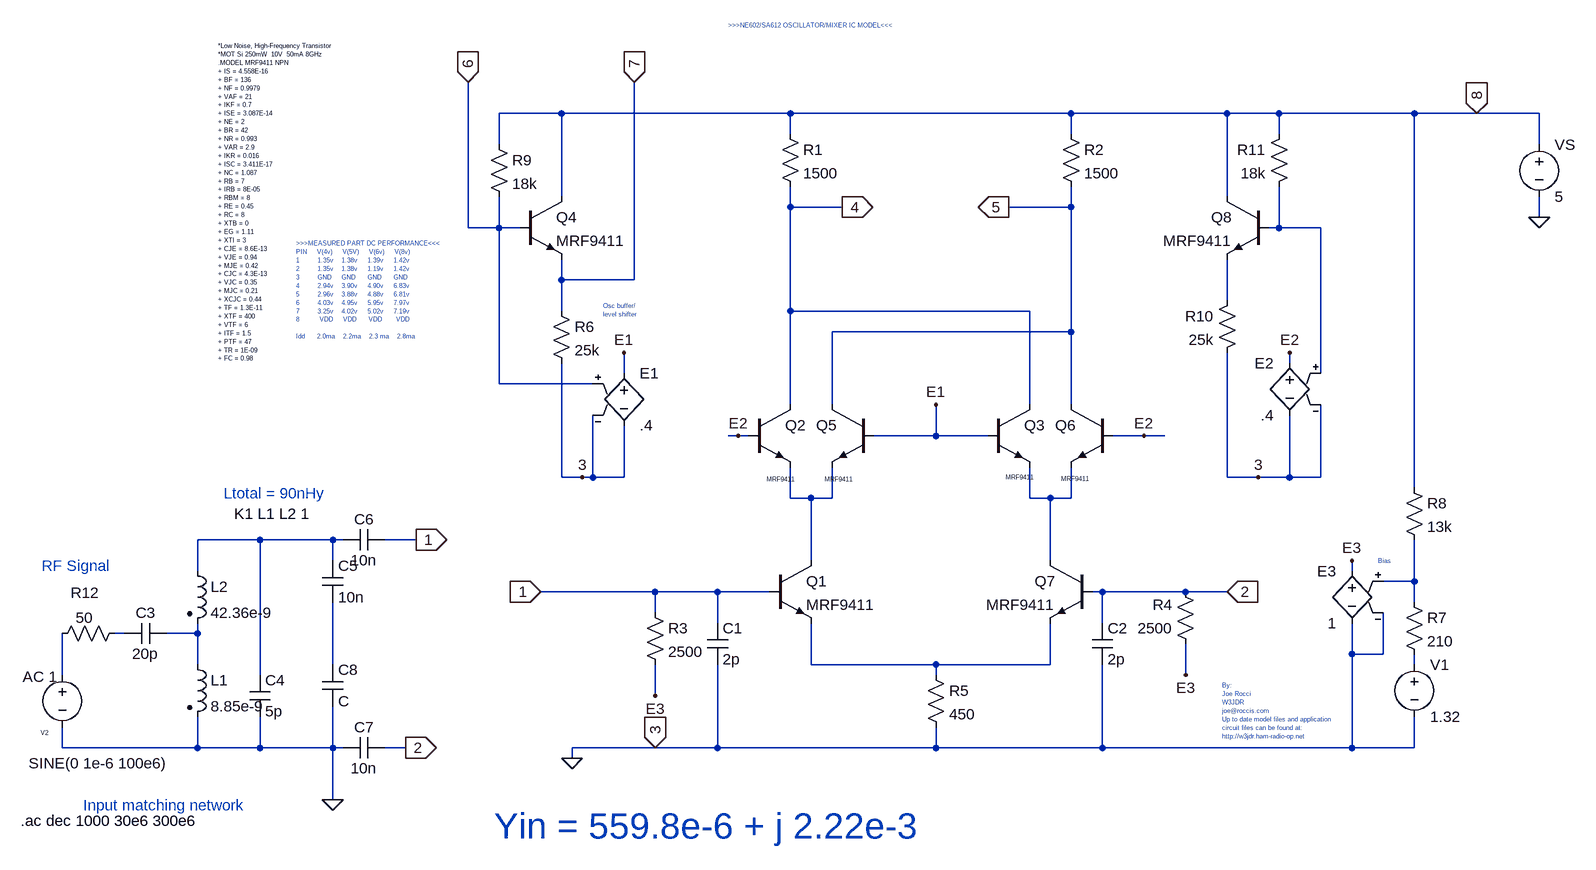
[diagram p0: schematic Mezclador_entrada.asc]
Mezclador_entrada.asc, the LTspice schematic file:
Version 4
SHEET 1 1112 816
WIRE -448 -384 -544 -384
WIRE -96 -384 -448 -384
WIRE 336 -384 -96 -384
WIRE 576 -384 336 -384
WIRE 656 -384 576 -384
WIRE 864 -384 656 -384
WIRE 960 -384 864 -384
WIRE 1056 -384 960 -384
WIRE -96 -352 -96 -384
WIRE 336 -352 336 -384
WIRE 656 -352 656 -384
WIRE -544 -336 -544 -384
WIRE 1056 -336 1056 -384
WIRE -448 -256 -448 -384
WIRE 576 -256 576 -384
WIRE -96 -240 -96 -272
WIRE -16 -240 -96 -240
WIRE 336 -240 336 -272
WIRE 336 -240 240 -240
WIRE 1056 -224 1056 -256
WIRE -592 -208 -592 -432
WIRE -544 -208 -544 -256
WIRE -544 -208 -592 -208
WIRE -512 -208 -544 -208
WIRE 656 -208 656 -272
WIRE 656 -208 640 -208
WIRE 720 -208 656 -208
WIRE -448 -128 -448 -160
WIRE -336 -128 -336 -432
WIRE -336 -128 -448 -128
WIRE 576 -96 576 -160
WIRE -448 -80 -448 -128
WIRE -96 -80 -96 -240
WIRE 272 -80 -96 -80
WIRE 336 -48 336 -240
WIRE 336 -48 -32 -48
WIRE 672 0 672 -16
WIRE -352 16 -352 -16
WIRE 720 16 720 -208
WIRE -544 32 -544 -208
WIRE -400 32 -544 32
WIRE -96 64 -96 -80
WIRE -32 64 -32 -48
WIRE 272 64 272 -80
WIRE 336 64 336 -48
WIRE -176 112 -192 112
WIRE -160 112 -176 112
WIRE 128 112 128 64
WIRE 128 112 32 112
WIRE 208 112 128 112
WIRE 448 112 400 112
WIRE 480 112 448 112
WIRE -448 176 -448 0
WIRE -416 176 -448 176
WIRE -400 176 -400 80
WIRE -400 176 -416 176
WIRE -352 176 -352 96
WIRE -352 176 -400 176
WIRE 576 176 576 -16
WIRE 624 176 576 176
WIRE 672 176 672 80
WIRE 672 176 624 176
WIRE 720 176 720 64
WIRE 720 176 672 176
WIRE 864 192 864 -384
WIRE -96 208 -96 160
WIRE -64 208 -96 208
WIRE -32 208 -32 160
WIRE -32 208 -64 208
WIRE 272 208 272 160
WIRE 304 208 272 208
WIRE 336 208 336 160
WIRE 336 208 304 208
WIRE -912 272 -1008 272
WIRE -800 272 -912 272
WIRE -784 272 -800 272
WIRE -672 272 -720 272
WIRE -800 304 -800 272
WIRE -64 304 -64 208
WIRE 304 304 304 208
WIRE -1008 320 -1008 272
WIRE 768 320 768 304
WIRE 864 336 864 272
WIRE 864 336 816 336
WIRE -304 352 -480 352
WIRE -208 352 -304 352
WIRE -128 352 -208 352
WIRE 384 352 368 352
WIRE 512 352 384 352
WIRE 576 352 512 352
WIRE 864 368 864 336
WIRE -304 384 -304 352
WIRE -208 400 -208 352
WIRE 384 400 384 352
WIRE -1120 416 -1136 416
WIRE -1008 416 -1008 400
WIRE -1008 416 -1056 416
WIRE 768 448 768 400
WIRE 816 448 816 384
WIRE 816 448 768 448
WIRE -1008 464 -1008 416
WIRE -800 464 -800 368
WIRE -64 464 -64 400
WIRE 128 464 -64 464
WIRE 304 464 304 400
WIRE 304 464 128 464
WIRE 864 464 864 448
WIRE -1216 480 -1216 416
WIRE -912 480 -912 272
WIRE 128 480 128 464
WIRE 512 480 512 432
WIRE -304 512 -304 464
WIRE -1216 592 -1216 560
WIRE -1008 592 -1008 544
WIRE -1008 592 -1216 592
WIRE -912 592 -912 544
WIRE -912 592 -1008 592
WIRE -800 592 -800 528
WIRE -800 592 -912 592
WIRE -784 592 -800 592
WIRE -688 592 -720 592
WIRE -304 592 -432 592
WIRE -208 592 -208 464
WIRE -208 592 -304 592
WIRE 128 592 128 560
WIRE 128 592 -208 592
WIRE 384 592 384 464
WIRE 384 592 128 592
WIRE 768 592 768 448
WIRE 768 592 384 592
WIRE 864 592 864 544
WIRE 864 592 768 592
WIRE -432 608 -432 592
WIRE -800 672 -800 592
FLAG 240 -240 5
IOPIN 240 -240 Out
FLAG -16 -240 4
IOPIN -16 -240 Out
FLAG 960 -384 8
IOPIN 960 -384 In
FLAG -592 -432 6
IOPIN -592 -432 In
FLAG -336 -432 7
IOPIN -336 -432 In
FLAG 576 352 2
IOPIN 576 352 In
FLAG -480 352 1
IOPIN -480 352 In
FLAG -304 592 3
IOPIN -304 592 In
FLAG -352 -16 E1
FLAG 128 64 E1
FLAG -176 112 E2
FLAG 448 112 E2
FLAG 672 -16 E2
FLAG -416 176 3
FLAG 624 176 3
FLAG -304 512 E3
FLAG 512 480 E3
FLAG 768 304 E3
FLAG -432 608 0
FLAG 1056 -224 0
FLAG -672 272 1
IOPIN -672 272 Out
FLAG -688 592 2
IOPIN -688 592 Out
FLAG -800 672 0
SYMBOL npn -128 304 R0
SYMATTR InstName Q1
SYMATTR Value MRF9411
SYMBOL res -112 -368 R0
SYMATTR InstName R1
SYMATTR Value 1500
SYMBOL res 320 -368 R0
SYMATTR InstName R2
SYMATTR Value 1500
SYMBOL res -320 368 R0
SYMATTR InstName R3
SYMATTR Value 2500
SYMBOL res 528 448 R180
WINDOW 0 36 76 Left 2
WINDOW 3 36 40 Left 2
SYMATTR InstName R4
SYMATTR Value 2500
SYMBOL res 112 464 R0
SYMATTR InstName R5
SYMATTR Value 450
SYMBOL res -464 -96 R0
SYMATTR InstName R6
SYMATTR Value 25k
SYMBOL res 848 352 R0
SYMATTR InstName R7
SYMATTR Value 210
SYMBOL voltage 864 448 R0
WINDOW 123 0 0 Left 0
WINDOW 39 0 0 Left 0
SYMATTR InstName V1
SYMATTR Value 1.32
SYMBOL res 848 176 R0
SYMATTR InstName R8
SYMATTR Value 13k
SYMBOL res -560 -352 R0
SYMATTR InstName R9
SYMATTR Value 18k
SYMBOL res 592 -112 M0
SYMATTR InstName R10
SYMATTR Value 25k
SYMBOL res 672 -368 M0
SYMATTR InstName R11
SYMATTR Value 18k
SYMBOL e -352 0 R0
SYMATTR InstName E1
SYMATTR Value .4
SYMBOL e 672 -16 M0
SYMATTR InstName E2
SYMATTR Value .4
SYMBOL npn -160 64 R0
WINDOW 3 117 115 Left 0
SYMATTR Value MRF9411
SYMATTR InstName Q2
SYMBOL npn 208 64 R0
WINDOW 3 113 114 Left 0
SYMATTR Value MRF9411
SYMATTR InstName Q3
SYMBOL npn -512 -256 R0
SYMATTR InstName Q4
SYMATTR Value MRF9411
SYMBOL npn 32 64 M0
WINDOW 3 120 115 Left 0
SYMATTR Value MRF9411
SYMATTR InstName Q5
SYMBOL npn 400 64 M0
WINDOW 3 120 112 Left 0
SYMATTR Value MRF9411
SYMATTR InstName Q6
SYMBOL npn 368 304 M0
SYMATTR InstName Q7
SYMATTR Value MRF9411
SYMBOL npn 640 -256 M0
SYMATTR InstName Q8
SYMATTR Value MRF9411
SYMBOL e 768 304 M0
SYMATTR InstName E3
SYMATTR Value 1
SYMBOL cap -224 400 R0
SYMATTR InstName C1
SYMATTR Value 2p
SYMBOL cap 368 400 R0
SYMATTR InstName C2
SYMATTR Value 2p
SYMBOL voltage 1056 -352 R0
SYMATTR InstName VS
SYMATTR Value 5
SYMBOL voltage -1216 464 R0
WINDOW 123 -61 19 Left 2
WINDOW 39 0 0 Left 0
WINDOW 0 -33 105 Left 0
WINDOW 3 -52 152 Left 2
SYMATTR Value2 AC 1
SYMATTR InstName V2
SYMATTR Value SINE(0 1e-6 100e6)
SYMBOL res -1120 400 R90
WINDOW 0 -31 61 VBottom 2
WINDOW 3 -24 62 VTop 2
SYMATTR InstName R12
SYMATTR Value 50
SYMBOL cap -1056 400 R90
WINDOW 0 0 32 VBottom 2
WINDOW 3 32 32 VTop 2
SYMATTR InstName C3
SYMATTR Value 20p
SYMBOL ind2 -1024 448 R0
SYMATTR InstName L1
SYMATTR Type ind
SYMATTR Value 8.85e-9
SYMBOL ind2 -1024 304 R0
SYMATTR InstName L2
SYMATTR Type ind
SYMATTR Value 42.36e-9
SYMBOL cap -928 480 R0
SYMATTR InstName C4
SYMATTR Value 5p
SYMBOL cap -816 304 R0
SYMATTR InstName C5
SYMATTR Value 10n
SYMBOL cap -720 256 R90
WINDOW 0 0 32 VBottom 2
WINDOW 3 32 32 VTop 2
SYMATTR InstName C6
SYMATTR Value 10n
SYMBOL cap -720 576 R90
WINDOW 0 0 32 VBottom 2
WINDOW 3 32 32 VTop 2
SYMATTR InstName C7
SYMATTR Value 10n
SYMBOL cap -816 464 R0
SYMATTR InstName C8
TEXT 808 304 Left 0 ;Bias
TEXT -384 -88 Left 0 ;Osc buffer/\nlevel shifter
TEXT -976 -488 Left 0 !*Low Noise, High-Frequency Transistor\n*MOT Si 250mW  10V  50mA 8GHz \n.MODEL MRF9411 NPN \n+ IS = 4.558E-16 \n+ BF = 136 \n+ NF = 0.9979 \n+ VAF = 21 \n+ IKF = 0.7 \n+ ISE = 3.087E-14 \n+ NE = 2 \n+ BR = 42 \n+ NR = 0.993 \n+ VAR = 2.9 \n+ IKR = 0.016 \n+ ISC = 3.411E-17 \n+ NC = 1.087 \n+ RB = 7 \n+ IRB = 8E-05 \n+ RBM = 8 \n+ RE = 0.45 \n+ RC = 8 \n+ XTB = 0 \n+ EG = 1.11 \n+ XTI = 3 \n+ CJE = 8.6E-13 \n+ VJE = 0.94 \n+ MJE = 0.42 \n+ CJC = 4.3E-13 \n+ VJC = 0.35 \n+ MJC = 0.21 \n+ XCJC = 0.44 \n+ TF = 1.3E-11 \n+ XTF = 400 \n+ VTF = 6 \n+ ITF = 1.5 \n+ PTF = 47 \n+ TR = 1E-09 \n+ FC = 0.98
TEXT -856 -184 Left 0 ;>>>MEASURED PART DC PERFORMANCE<<<\nPIN     V(4v)     V(5V)     V(6v)     V(8v)\n1         1.35v    1.38v     1.39v     1.42v\n2         1.35v    1.38v     1.19v     1.42v\n3         GND     GND      GND      GND\n4         2.94v    3.90v     4.90v     6.83v \n5         2.96v    3.88v     4.88v     6.81v\n6         4.03v    4.95v     5.95v     7.97v\n7         3.25v    4.02v     5.02v     7.19v\n8          VDD     VDD      VDD       VDD\n \nIdd      2.0ma    2.2ma    2.3 ma    2.8ma
TEXT 568 496 Left 0 ;By:\nJoe Rocci\nW3JDR\njoe@roccis.com\nUp to date model files and application\ncircuit files can be found at:\nhttp://w3jdr.ham-radio-op.net
TEXT -192 -520 Left 0 ;>>>NE602/SA612 OSCILLATOR/MIXER IC MODEL<<<
TEXT -1184 680 Left 2 ;Input matching network
TEXT -1248 312 Left 2 ;RF Signal
TEXT -968 200 Left 2 ;Ltotal = 90nHy
TEXT -952 232 Left 2 !K1 L1 L2 1
TEXT -1280 704 Left 2 !.ac dec 1000 30e6 300e6
TEXT -552 712 Left 5 ;Yin = 559.8e-6 + j 2.22e-3

The netlist it stands for:
* Mezclador_entrada.asc
Q1 N003 1 N010 0 MRF9411
R1 8 4 1500
R2 8 5 1500
R3 1 E3 2500
R4 E3 2 2500
R5 N010 0 450
R6 7 0 25k
R7 N006 N011 210
V1 N011 0 1.32
R8 8 N006 13k
R9 8 6 18k
R10 N002 0 25k
R11 8 N001 18k
E1 E1 0 6 0 .4
E2 E2 0 N001 0 .4
Q2 4 E2 N003 0 MRF9411
Q3 4 E1 N004 0 MRF9411
Q4 8 6 7 0 MRF9411
Q5 5 E1 N003 0 MRF9411
Q6 5 E2 N004 0 MRF9411
Q7 N004 2 N010 0 MRF9411
Q8 8 N001 N002 0 MRF9411
E3 E3 0 N006 0 1
C1 1 0 2p
C2 2 0 2p
VS 8 0 5
V2 N012 0 SINE(0 1e-6 100e6) AC 1
R12 N007 N012 50
C3 N008 N007 20p
L1 N008 0 8.85e-9
L2 N005 N008 42.36e-9
C4 N005 0 5p
C5 N005 N009 10n
C6 1 N005 10n
C7 2 0 10n
C8 N009 0 C
.model NPN NPN
.model PNP PNP
.lib standard.bjt
* Bias
* Osc buffer/
* level shifter
*Low Noise, High-Frequency Transistor
*MOT Si 250mW  10V  50mA 8GHz
.MODEL MRF9411 NPN
+ IS = 4.558E-16
+ BF = 136
+ NF = 0.9979
+ VAF = 21
+ IKF = 0.7
+ ISE = 3.087E-14
+ NE = 2
+ BR = 42
+ NR = 0.993
+ VAR = 2.9
+ IKR = 0.016
+ ISC = 3.411E-17
+ NC = 1.087
+ RB = 7
+ IRB = 8E-05
+ RBM = 8
+ RE = 0.45
+ RC = 8
+ XTB = 0
+ EG = 1.11
+ XTI = 3
+ CJE = 8.6E-13
+ VJE = 0.94
+ MJE = 0.42
+ CJC = 4.3E-13
+ VJC = 0.35
+ MJC = 0.21
+ XCJC = 0.44
+ TF = 1.3E-11
+ XTF = 400
+ VTF = 6
+ ITF = 1.5
+ PTF = 47
+ TR = 1E-09
+ FC = 0.98
* >>>MEASURED PART DC PERFORMANCE<<<
* PIN     V(4v)     V(5V)     V(6v)     V(8v)
* 1         1.35v    1.38v     1.39v     1.42v
* 2         1.35v    1.38v     1.19v     1.42v
* 3         GND     GND      GND      GND
* 4         2.94v    3.90v     4.90v     6.83v
* 5         2.96v    3.88v     4.88v     6.81v
* 6         4.03v    4.95v     5.95v     7.97v
* 7         3.25v    4.02v     5.02v     7.19v
* 8          VDD     VDD      VDD       VDD
* Idd      2.0ma    2.2ma    2.3 ma    2.8ma
* By:
* Joe Rocci
* W3JDR
* joe@roccis.com
* Up to date model files and application
* circuit files can be found at:
* http://w3jdr.ham-radio-op.net
* >>>NE602/SA612 OSCILLATOR/MIXER IC MODEL<<<
* Input matching network
* RF Signal
* Ltotal = 90nHy
K1 L1 L2 1
.ac dec 1000 30e6 300e6
* Yin = 559.8e-6 + j 2.22e-3
.backanno
.end